# Altium schematic sheet SYS_ARCHITACTURE.SchDoc: SYS_ARCHITACTURE
size A3; DocumentNumber: 4; Revision: V1.5; SheetNumber: 4; SheetTotal: 11; PageSetup: Record=PageOptions|CenterHorizontal=True|CenterVertical=True|PrintScale=1.01|XCorrection=1.00|YCorrection=1.00|PrintKind=0|BorderSize=5000000|LeftOffset=0|BottomOffset=0|Orientation=2|PaperLength=1000|PaperWidth=1000|Scale=100|PaperSource=7|PrintQuality=600|MediaType=1|DitherType=10|PrintScaleMode=1|PaperKind=A3(297x420mm)|PaperIndex=8
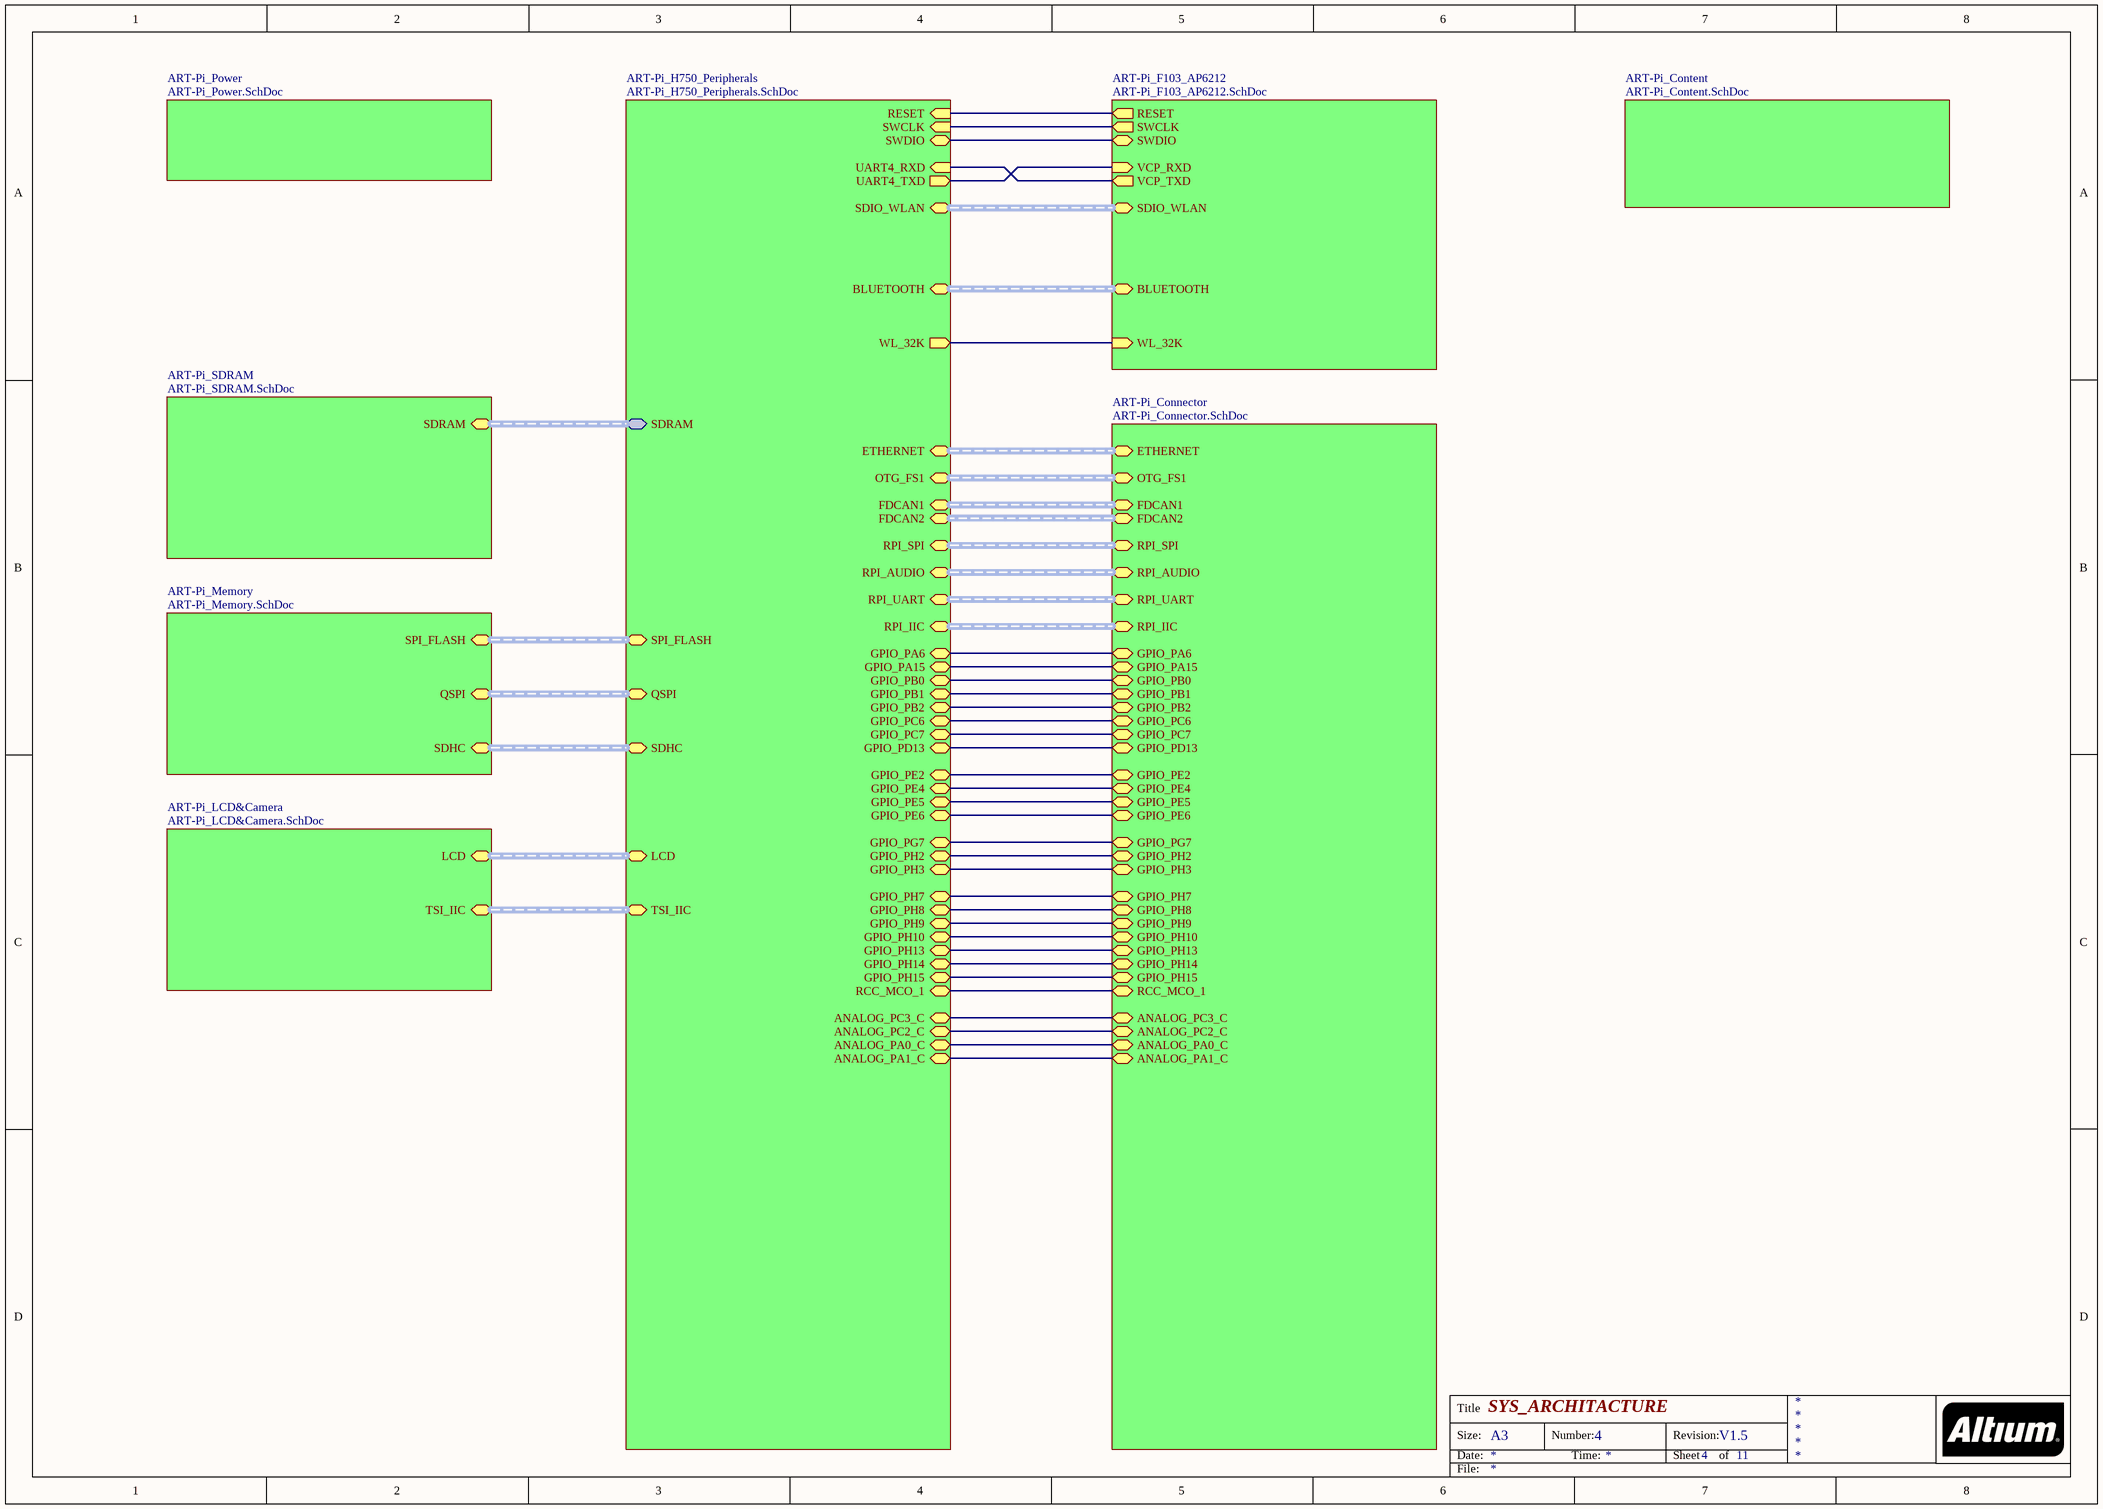
[diagram p0: SYS_ARCHITACTURE.SchDoc]

## Sub-sheets
ART-Pi_Connector = ART-Pi_Connector.SchDoc: OTG_FS1 (harness Harness), FDCAN1 (harness Harness), FDCAN2 (harness Harness), RPI_SPI (harness Harness), RPI_UART (harness Harness), RPI_IIC (harness Harness), GPIO_PA6, GPIO_PA15, GPIO_PB0, GPIO_PB1, GPIO_PB2, GPIO_PC6, GPIO_PC7, GPIO_PD13, GPIO_PE2, GPIO_PE5, GPIO_PE4, GPIO_PE6, GPIO_PG7, GPIO_PH2, GPIO_PH3, GPIO_PH7, GPIO_PH8, GPIO_PH9, GPIO_PH10, GPIO_PH13, GPIO_PH14, GPIO_PH15, RCC_MCO_1, ANALOG_PC3_C, ANALOG_PC2_C, ANALOG_PA0_C, ANALOG_PA1_C, ETHERNET (harness Harness), RPI_AUDIO (harness Harness)
ART-Pi_Content = ART-Pi_Content.SchDoc: no entries
ART-Pi_F103_AP6212 = ART-Pi_F103_AP6212.SchDoc: RESET (out), SWCLK (out), SWDIO (bidir), VCP_RXD (in), VCP_TXD (out), SDIO_WLAN (harness Harness), BLUETOOTH (harness Harness), WL_32K (in)
ART-Pi_H750_Peripherals = ART-Pi_H750_Peripherals.SchDoc: SDRAM (harness Harness), SPI_FLASH (harness Harness), QSPI (harness Harness), SDHC (harness Harness), LCD (harness Harness), TSI_IIC (harness Harness), RESET (in), SWCLK (in), SWDIO (bidir), UART4_RXD (in), UART4_TXD (out), SDIO_WLAN (harness Harness), BLUETOOTH (harness Harness), WL_32K (out), ETHERNET (harness Harness), OTG_FS1 (harness Harness), FDCAN1 (harness Harness), FDCAN2 (harness Harness), RPI_SPI (harness Harness), RPI_UART (harness Harness), RPI_IIC (harness Harness), GPIO_PA6, GPIO_PA15, GPIO_PB0, GPIO_PB1, GPIO_PB2, GPIO_PC6, GPIO_PC7, GPIO_PD13, GPIO_PE2, GPIO_PE5, GPIO_PE4, GPIO_PE6, GPIO_PG7, GPIO_PH2, GPIO_PH3, GPIO_PH7, GPIO_PH8, GPIO_PH9, GPIO_PH10, GPIO_PH13, GPIO_PH14, GPIO_PH15, RCC_MCO_1, ANALOG_PC3_C, ANALOG_PC2_C, ANALOG_PA0_C, ANALOG_PA1_C, RPI_AUDIO (harness Harness)
ART-Pi_LCD&Camera = ART-Pi_LCD&Camera.SchDoc: LCD (harness Harness), TSI_IIC (harness Harness)
ART-Pi_Memory = ART-Pi_Memory.SchDoc: SPI_FLASH (harness Harness), QSPI (harness Harness), SDHC (harness Harness)
ART-Pi_Power = ART-Pi_Power.SchDoc: no entries
ART-Pi_SDRAM = ART-Pi_SDRAM.SchDoc: SDRAM (harness Harness)

## Nets
(unnamed): sheet ART-Pi_H750_Peripherals/RESET, sheet ART-Pi_F103_AP6212/RESET
(unnamed): sheet ART-Pi_H750_Peripherals/SWCLK, sheet ART-Pi_F103_AP6212/SWCLK
(unnamed): sheet ART-Pi_H750_Peripherals/SWDIO, sheet ART-Pi_F103_AP6212/SWDIO
(unnamed): sheet ART-Pi_H750_Peripherals/UART4_RXD, sheet ART-Pi_F103_AP6212/VCP_TXD
(unnamed): sheet ART-Pi_H750_Peripherals/UART4_TXD, sheet ART-Pi_F103_AP6212/VCP_RXD
(unnamed): sheet ART-Pi_H750_Peripherals/WL_32K, sheet ART-Pi_F103_AP6212/WL_32K
(unnamed): sheet ART-Pi_H750_Peripherals/GPIO_PA6, sheet ART-Pi_Connector/GPIO_PA6
(unnamed): sheet ART-Pi_H750_Peripherals/GPIO_PA15, sheet ART-Pi_Connector/GPIO_PA15
(unnamed): sheet ART-Pi_H750_Peripherals/GPIO_PB0, sheet ART-Pi_Connector/GPIO_PB0
(unnamed): sheet ART-Pi_H750_Peripherals/GPIO_PB1, sheet ART-Pi_Connector/GPIO_PB1
(unnamed): sheet ART-Pi_H750_Peripherals/GPIO_PB2, sheet ART-Pi_Connector/GPIO_PB2
(unnamed): sheet ART-Pi_H750_Peripherals/GPIO_PC6, sheet ART-Pi_Connector/GPIO_PC6
(unnamed): sheet ART-Pi_H750_Peripherals/GPIO_PC7, sheet ART-Pi_Connector/GPIO_PC7
(unnamed): sheet ART-Pi_H750_Peripherals/GPIO_PD13, sheet ART-Pi_Connector/GPIO_PD13
(unnamed): sheet ART-Pi_H750_Peripherals/GPIO_PE2, sheet ART-Pi_Connector/GPIO_PE2
(unnamed): sheet ART-Pi_H750_Peripherals/GPIO_PE5, sheet ART-Pi_Connector/GPIO_PE5
(unnamed): sheet ART-Pi_H750_Peripherals/GPIO_PE4, sheet ART-Pi_Connector/GPIO_PE4
(unnamed): sheet ART-Pi_H750_Peripherals/GPIO_PE6, sheet ART-Pi_Connector/GPIO_PE6
(unnamed): sheet ART-Pi_H750_Peripherals/GPIO_PG7, sheet ART-Pi_Connector/GPIO_PG7
(unnamed): sheet ART-Pi_H750_Peripherals/GPIO_PH2, sheet ART-Pi_Connector/GPIO_PH2
(unnamed): sheet ART-Pi_H750_Peripherals/GPIO_PH3, sheet ART-Pi_Connector/GPIO_PH3
(unnamed): sheet ART-Pi_H750_Peripherals/GPIO_PH7, sheet ART-Pi_Connector/GPIO_PH7
(unnamed): sheet ART-Pi_H750_Peripherals/GPIO_PH8, sheet ART-Pi_Connector/GPIO_PH8
(unnamed): sheet ART-Pi_H750_Peripherals/GPIO_PH9, sheet ART-Pi_Connector/GPIO_PH9
(unnamed): sheet ART-Pi_H750_Peripherals/GPIO_PH10, sheet ART-Pi_Connector/GPIO_PH10
(unnamed): sheet ART-Pi_H750_Peripherals/GPIO_PH13, sheet ART-Pi_Connector/GPIO_PH13
(unnamed): sheet ART-Pi_H750_Peripherals/GPIO_PH14, sheet ART-Pi_Connector/GPIO_PH14
(unnamed): sheet ART-Pi_H750_Peripherals/GPIO_PH15, sheet ART-Pi_Connector/GPIO_PH15
(unnamed): sheet ART-Pi_H750_Peripherals/RCC_MCO_1, sheet ART-Pi_Connector/RCC_MCO_1
(unnamed): sheet ART-Pi_H750_Peripherals/ANALOG_PC3_C, sheet ART-Pi_Connector/ANALOG_PC3_C
(unnamed): sheet ART-Pi_H750_Peripherals/ANALOG_PC2_C, sheet ART-Pi_Connector/ANALOG_PC2_C
(unnamed): sheet ART-Pi_H750_Peripherals/ANALOG_PA0_C, sheet ART-Pi_Connector/ANALOG_PA0_C
(unnamed): sheet ART-Pi_H750_Peripherals/ANALOG_PA1_C, sheet ART-Pi_Connector/ANALOG_PA1_C

## Buses and harness runs
harness sheet ART-Pi_Connector/ETHERNET = sheet ART-Pi_H750_Peripherals/ETHERNET
harness sheet ART-Pi_Connector/FDCAN1 = sheet ART-Pi_H750_Peripherals/FDCAN1
harness sheet ART-Pi_Connector/FDCAN2 = sheet ART-Pi_H750_Peripherals/FDCAN2
harness sheet ART-Pi_Connector/OTG_FS1 = sheet ART-Pi_H750_Peripherals/OTG_FS1
harness sheet ART-Pi_Connector/RPI_AUDIO = sheet ART-Pi_H750_Peripherals/RPI_AUDIO
harness sheet ART-Pi_Connector/RPI_IIC = sheet ART-Pi_H750_Peripherals/RPI_IIC
harness sheet ART-Pi_Connector/RPI_SPI = sheet ART-Pi_H750_Peripherals/RPI_SPI
harness sheet ART-Pi_Connector/RPI_UART = sheet ART-Pi_H750_Peripherals/RPI_UART
harness sheet ART-Pi_F103_AP6212/BLUETOOTH = sheet ART-Pi_H750_Peripherals/BLUETOOTH
harness sheet ART-Pi_F103_AP6212/SDIO_WLAN = sheet ART-Pi_H750_Peripherals/SDIO_WLAN
harness sheet ART-Pi_H750_Peripherals/LCD = sheet ART-Pi_LCD&Camera/LCD
harness sheet ART-Pi_H750_Peripherals/QSPI = sheet ART-Pi_Memory/QSPI
harness sheet ART-Pi_H750_Peripherals/SDHC = sheet ART-Pi_Memory/SDHC
harness sheet ART-Pi_H750_Peripherals/SDRAM = sheet ART-Pi_SDRAM/SDRAM
harness sheet ART-Pi_H750_Peripherals/SPI_FLASH = sheet ART-Pi_Memory/SPI_FLASH
harness sheet ART-Pi_H750_Peripherals/TSI_IIC = sheet ART-Pi_LCD&Camera/TSI_IIC

## Notes on the sheet
- Title
- Size:
- Date:
- A3
- Number:
- Time:
- Revision:
- Sheet
- of
- File: